# EAGLE design th (EAGLE 9.3.0)
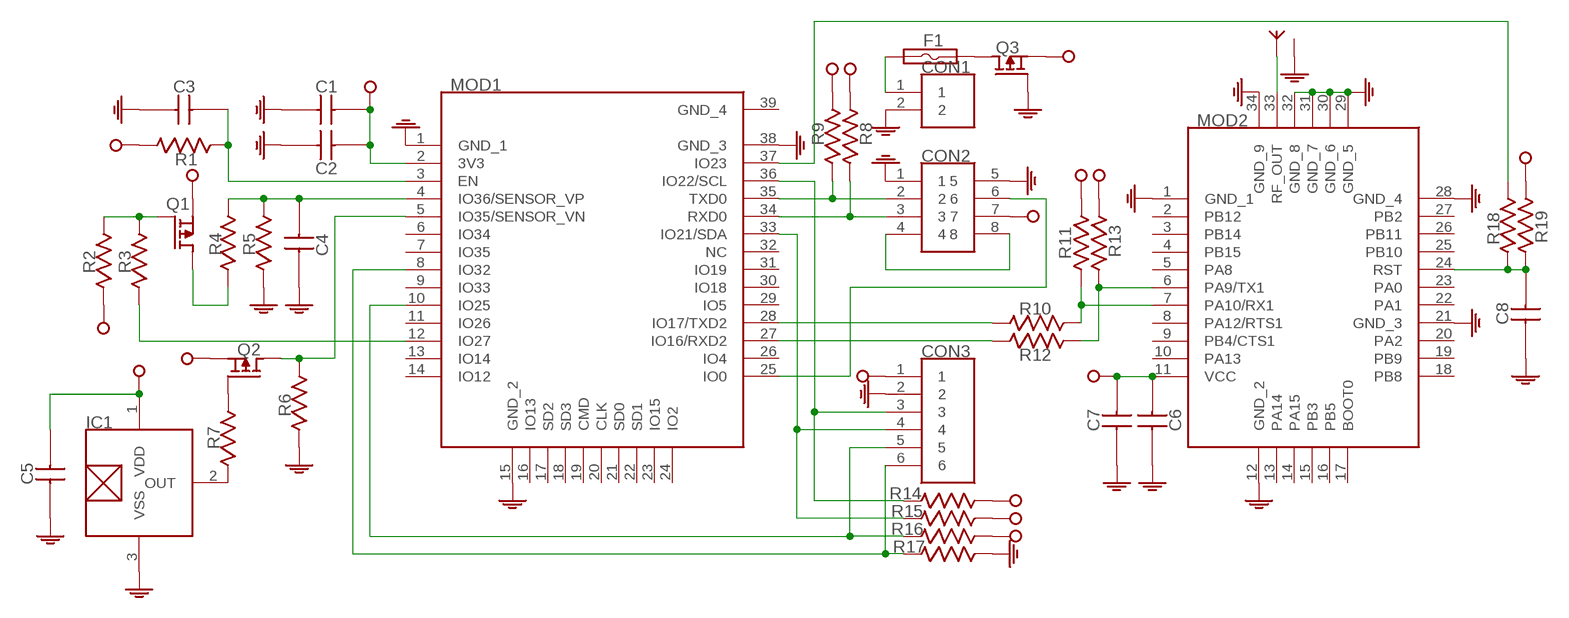
[diagram p0: schematic, sheet 1]

## Parts
ANT1  SMA-RF  [SMA-RF]
C1  CAPACITOR-0805  [0805]
C2  CAPACITOR-0603  [0603]
C3  CAPACITOR-0603  [0603]
C4  CAPACITOR-0603  [0603]
C5  CAPACITOR-0603  [0603]
C6  CAPACITOR-0805  [0805]
C7  CAPACITOR-0603  [0603]
C8  CAPACITOR-0603  [0603]
CON1  JST-PH-2-2.0MM  [JST-PH-2-2.0MM]
CON2  HEADER-8P-2R-DIP-2_0MM  [HEADER-8P-2R-DIP-2_0MM]
CON3  CON-6P-3_81-PLUG  [CON-6P-3_81-PLUG]
F1  FUSE-0805  [0805]
IC1  S-5712-SOT23-3  [SOT23-3]
MOD1  ESP32-WROOM-32D  [ESP32-WROOM-32D]
MOD2  RAK811  [RAK811]
Q1  P-MOSFET  [SOT23-3]
Q2  P-MOSFET  [SOT23-3]
Q3  P-MOSFET  [SOT23-3]
R1  RESISTOR-0603  [0603]
R2  RESISTOR-0603  [0603]
R3  RESISTOR-0603  [0603]
R4  RESISTOR-0603  [0603]
R5  RESISTOR-0603  [0603]
R6  RESISTOR-0603  [0603]
R7  RESISTOR-0603  [0603]
R8  RESISTOR-0603  [0603]
R9  RESISTOR-0603  [0603]
R10  RESISTOR-0603  [0603]
R11  RESISTOR-0603  [0603]
R12  RESISTOR-0603  [0603]
R13  RESISTOR-0603  [0603]
R14  RESISTOR-0603  [0603]
R15  RESISTOR-0603  [0603]
R16  RESISTOR-0603  [0603]
R17  RESISTOR-0603  [0603]
R18  RESISTOR-0603  [0603]
R19  RESISTOR-0603  [0603]

## Nets
GND: ANT1.2(GND) ANT1.3(GND) ANT1.4(GND) ANT1.5(GND) C1.1 C2.1 C3.1 C4.1 C5.1 C6.1 C7.1 C8.1 CON1.2 CON2.1 CON2.5 CON3.2 IC1.3(VSS) MOD1.1(GND_1) MOD1.15(GND_2) MOD1.38(GND_3) MOD2.1(GND_1) MOD2.12(GND_2) MOD2.21(GND_3) MOD2.28(GND_4) MOD2.29(GND_5) MOD2.30(GND_6) MOD2.31(GND_7) MOD2.32(GND_8) MOD2.34(GND_9) Q3.1(G) R5.1 R6.1 R17.2
N$1: C3.2 MOD1.3(EN) R1.2
N$2: IC1.2(OUT) R7.1
N$3: MOD2.6(PA9/TX1) R12.2 R13.2
N$4: MOD2.7(PA10/RX1) R10.2 R11.2
N$5: Q2.1(G) R7.2
N$6: MOD1.28(IO17/TXD2) R10.1
N$7: MOD1.27(IO16/RXD2) R12.1
N$8: CON2.2 MOD1.35(TXD0) R9.1
N$9: CON2.3 MOD1.34(RXD0) R8.1
N$10: CON2.4 CON2.8
N$11: CON2.6 MOD1.25(IO0)
N$12: CON3.4 MOD1.33(IO21/SDA) R15.1
N$13: CON3.3 MOD1.36(IO22/SCL) R14.1
N$14: CON3.5 MOD1.10(IO25) R16.1
N$15: CON3.6 MOD1.8(IO32) R17.1
N$16: Q1.3(D) R4.1
N$17: C4.2 MOD1.4(IO36/SENSOR_VP) R4.2 R5.2
N$18: Q1.1(G) R2.2 R3.2
N$19: MOD1.12(IO27) R3.1
N$20: MOD1.5(IO35/SENSOR_VN) Q2.3(D) R6.2
N$21: ANT1.1(ANT) MOD2.33(RF_OUT)
N$22: C8.2 MOD2.24(RST) R18.1 R19.1
N$23: MOD1.37(IO23) R18.2
N$24: F1.2 Q3.3(D)
N$25: CON1.1 F1.1
VCC: C1.2 C2.2 C5.2 C6.2 C7.2 CON2.7 CON3.1 IC1.1(VDD) MOD1.2(3V3) MOD2.11(VCC) Q1.2(S) Q2.2(S) Q3.2(S) R1.1 R2.1 R8.2 R9.2 R11.1 R13.1 R14.2 R15.2 R16.2 R19.2
Unconnected: MOD1.6(IO34) MOD1.7(IO35) MOD1.9(IO33) MOD1.11(IO26) MOD1.13(IO14) MOD1.14(IO12) MOD1.16(IO13) MOD1.17(SD2) MOD1.18(SD3) MOD1.19(CMD) MOD1.20(CLK) MOD1.21(SD0) MOD1.22(SD1) MOD1.23(IO15) MOD1.24(IO2) MOD1.26(IO4) MOD1.29(IO5) MOD1.30(IO18) MOD1.31(IO19) MOD1.32(NC) MOD2.2(PB12) MOD2.3(PB14) MOD2.4(PB15) MOD2.5(PA8) MOD2.8(PA12/RTS1) MOD2.9(PB4/CTS1) MOD2.10(PA13) MOD2.13(PA14) MOD2.14(PA15) MOD2.15(PB3) MOD2.16(PB5) MOD2.17(BOOT0) MOD2.18(PB8) MOD2.19(PB9) MOD2.20(PA2) MOD2.22(PA1) MOD2.23(PA0) MOD2.25(PB10) MOD2.26(PB11) MOD2.27(PB2)

## Power pins joined to a net without a drawn wire
GND_4: MOD1.39(GND_4)

## Library data of the parts
ANT1 = SamacSys_Parts:SMA-RF
C1 C6 = SamacSys_Parts:CAPACITOR-0805
C2-C5 C7 C8 = SamacSys_Parts:CAPACITOR-0603
CON1 = SamacSys_Parts:JST-PH-2-2.0MM
CON2 = SamacSys_Parts:HEADER-8P-2R-DIP-2_0MM
CON3 = SamacSys_Parts:CON-6P-3_81-PLUG
F1 = SamacSys_Parts:FUSE-0805
IC1 = SamacSys_Parts:S-5712-SOT23-3
MOD1 = SamacSys_Parts:ESP32-WROOM-32D
MOD2 = SamacSys_Parts:RAK811
Q1-Q3 = SamacSys_Parts:P-MOSFET
R1-R19 = SamacSys_Parts:RESISTOR-0603

## Board
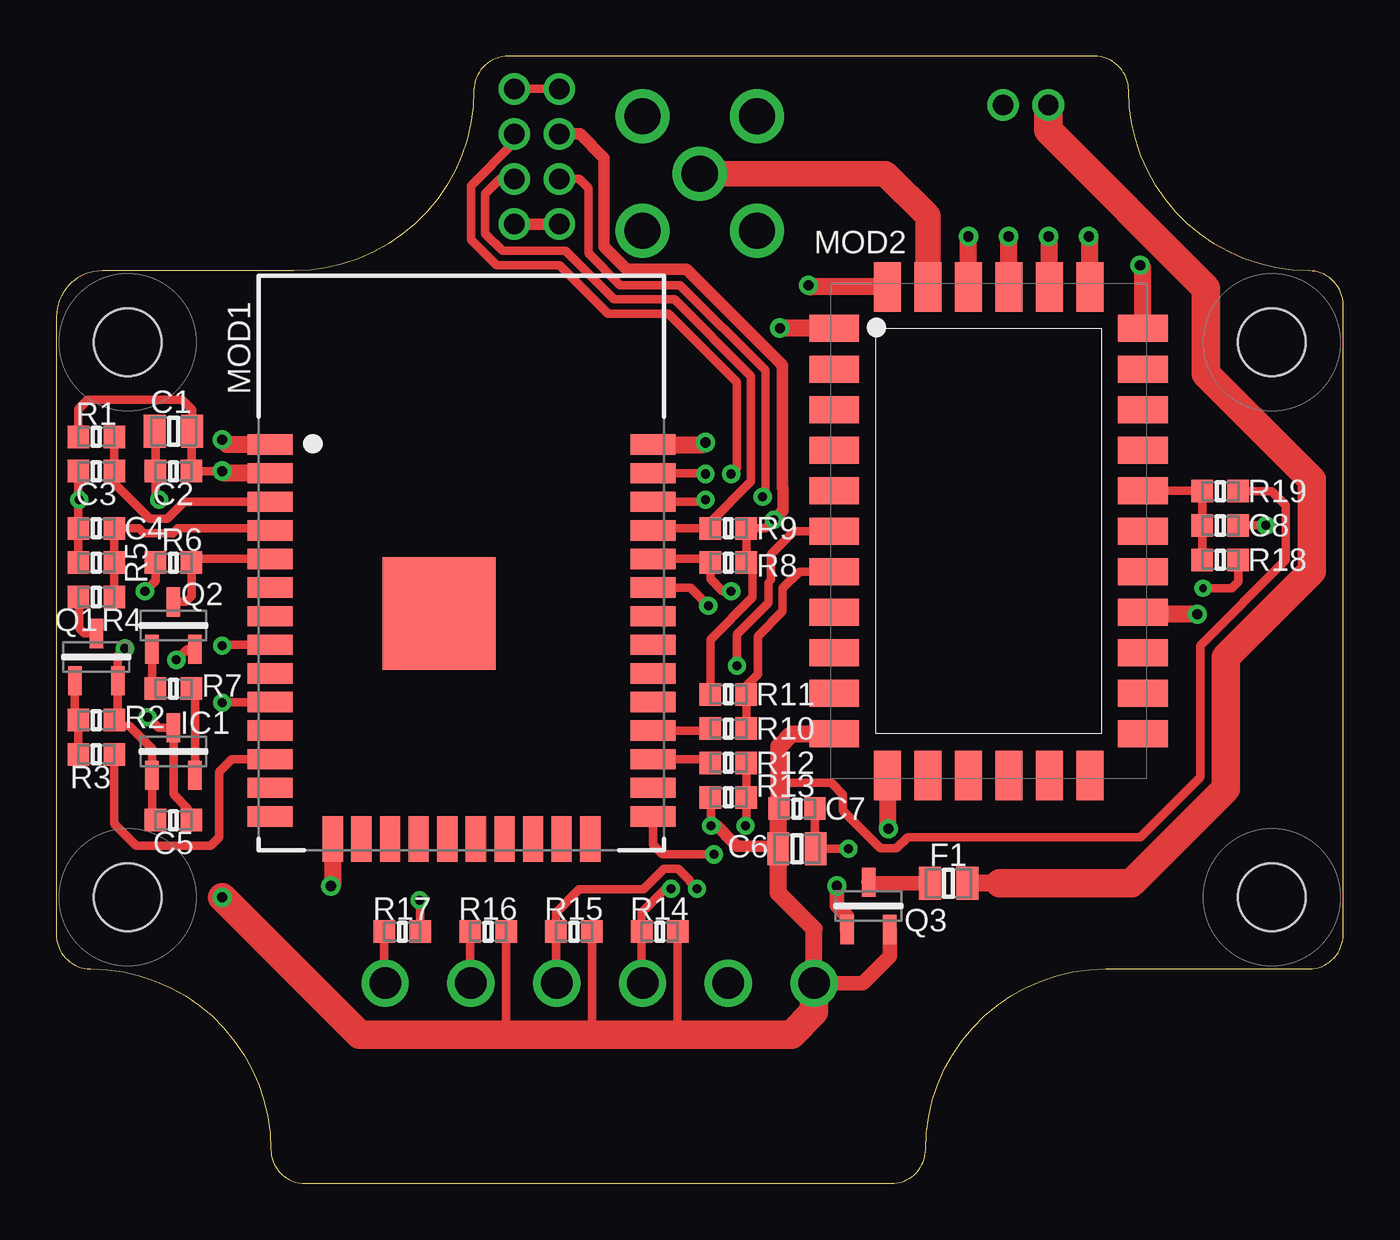
[diagram p1: board, top side]
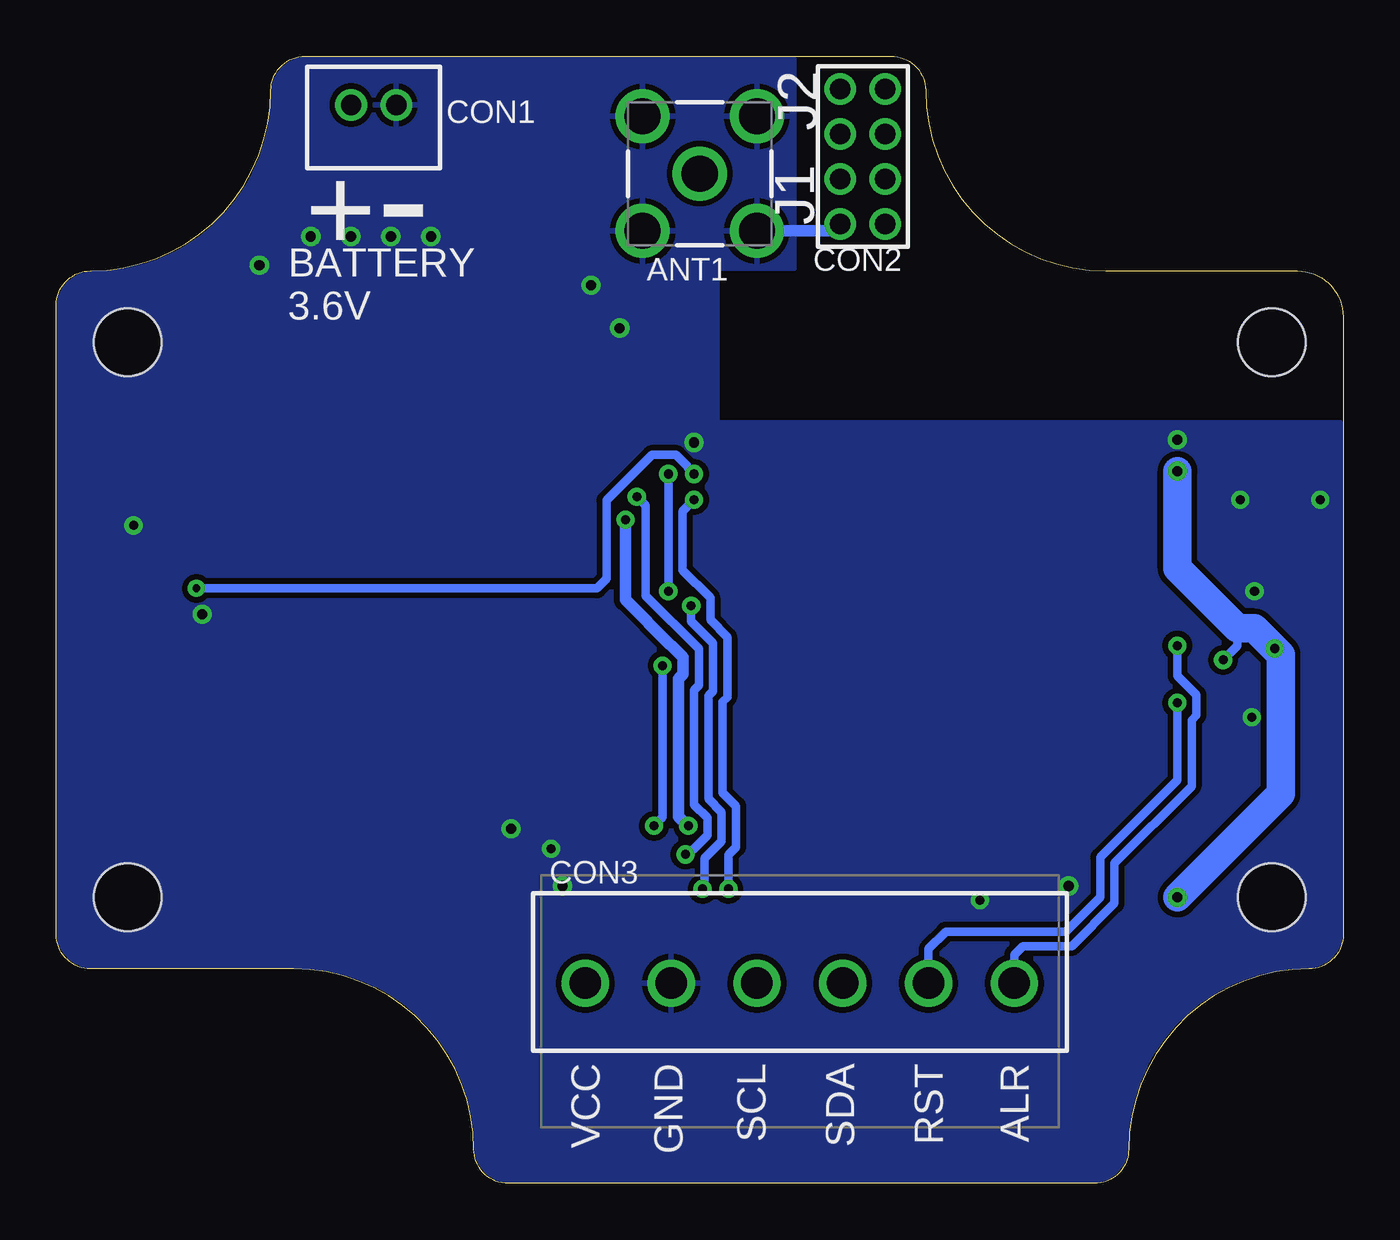
[diagram p2: board, bottom side, seen from below]

Size 57.15 x 50.04 mm. Coordinates in mm from the lower left corner, seen from the top.
Outline: 0,38.48 0,11.05 arc90 1.52,9.53 arc-90 9.53,1.52 arc90 11.05,0 37.08,0 arc90 38.61,1.52 arc-90 46.61,9.53 55.63,9.53 arc90 57.15,11.05 57.15,38.99 arc90 55.63,40.51 arc-90 47.62,48.51 arc90 46.1,50.04 20.07,50.04 arc90 18.54,48.51 arc-90 10.54,40.51 2.03,40.51 arc90 0,38.48
Copper layers (1*16): Top 0.035mm / dielectric 1.5mm / Bottom 0.035mm
Design rules "default": minimum track width 15mil, minimum drill 0.35mm, track to track 10mil, track to pad 10mil, pad to pad 10mil, via to via 10mil, smd to smd 0mil, copper to edge 0mil, drill to drill 6mil, minimum pad ring 10mil, minimum via ring 8mil, stop-mask expansion 4mil, vias tented up to drill 25mil, thermal gap 10mil
Holes 3 mm at 3.17,37.34 53.98,37.34 3.17,12.7 53.98,12.7

### Footprints (pad centres in the part's own frame; a part is rotated, then mirrored left to right if it is on the bottom)
SMA-RF = drill 1.6: 1 0,0; 2 -2.54,2.54; 3 -2.54,-2.54; 4 2.54,-2.54; 5 2.54,2.54
0805 = smd 0.97 x 1.47: 1 -0.83,0; 2 0.83,0
0603 = smd 0.95 x 1: 1 -0.8,0; 2 0.8,0
JST-PH-2-2.0MM = drill 0.9: 1 -1,0; 2 1,0
HEADER-8P-2R-DIP-2_0MM = drill 0.9: 1 -3,-1; 2 -1,-1; 3 1,-1; 4 3,-1; 5 -3,1; 6 -1,1; 7 1,1; 8 3,1
CON-6P-3_81-PLUG = drill 1.4: 1 -9.525,0; 2 -5.715,0; 3 -1.905,0; 4 1.905,0; 5 5.715,0; 6 9.525,0
SOT23-3 = smd 1.3 x 0.6: 1 -1.05,0.95; 2 -1.05,-0.95; 3 1.05,0
ESP32-WROOM-32D = smd 2 x 0.9: 1 -8.537,8.292; 2 -8.537,7.022; 3 -8.537,5.752; 4 -8.537,4.482; 5 -8.537,3.212; 6 -8.537,1.942; 7 -8.537,0.672; 8 -8.537,-0.598; 9 -8.537,-1.868; 10 -8.537,-3.138; 11 -8.537,-4.408; 12 -8.537,-5.678; 13 -8.537,-6.948; 14 -8.537,-8.218; 25 8.463,-8.218; 26 8.463,-6.948; 27 8.463,-5.678; 28 8.463,-4.408; 29 8.463,-3.138; 30 8.463,-1.868; 31 8.463,-0.598; 32 8.463,0.672; 33 8.463,1.942; 34 8.463,3.212; 35 8.463,4.482; 36 8.463,5.752; 37 8.463,7.022; 38 8.463,8.292 | smd 0.9 x 2: 15 -5.752,-9.218; 16 -4.482,-9.218; 17 -3.212,-9.218; 18 -1.942,-9.218; 19 -0.672,-9.218; 20 0.598,-9.218; 21 1.868,-9.218; 22 3.138,-9.218; 23 4.408,-9.218; 24 5.678,-9.218 | smd 5 x 5: 39 -1.037,0.792
RAK811 = smd 2.2 x 1.2: 1 -6.85,9; 2 -6.85,7.2; 3 -6.85,5.4; 4 -6.85,3.6; 5 -6.85,1.8; 6 -6.85,0; 7 -6.85,-1.8; 8 -6.85,-3.6; 9 -6.85,-5.4; 10 -6.85,-7.2; 11 -6.85,-9; 18 6.85,-9; 19 6.85,-7.2; 20 6.85,-5.4; 21 6.85,-3.6; 22 6.85,-1.8; 23 6.85,0; 24 6.85,1.8; 25 6.85,3.6; 26 6.85,5.4; 27 6.85,7.2; 28 6.85,9 | smd 1.2 x 2.2: 12 -4.5,-10.85; 13 -2.7,-10.85; 14 -0.9,-10.85; 15 0.9,-10.85; 16 2.7,-10.85; 17 4.5,-10.85; 29 4.5,10.85; 30 2.7,10.85; 31 0.9,10.85; 32 -0.9,10.85; 33 -2.7,10.85; 34 -4.5,10.85

### Placement (x,y rotation side)
ANT1  28.57,44.83 0 bottom
C1  5.21,33.4 0 top
C2  5.21,31.62 0 top
C3  1.78,31.62 0 top
C4  1.78,29.08 0 top
C5  5.21,16.13 180 top
C6  32.89,14.86 180 top
C7  32.89,16.64 180 top
C8  51.69,29.21 180 top
CON1  43.05,47.88 0 bottom
CON2  21.34,45.59 90 bottom
CON3  24.13,8.89 0 bottom
F1  39.62,13.34 180 top
IC1  5.21,19.18 90 top
MOD1  18.03,24.51 0 top
MOD2  41.4,28.96 0 top
Q1  1.78,23.37 90 top
Q2  5.21,24.77 90 top
Q3  36.07,12.32 90 top
R1  1.78,33.15 0 top
R2  1.78,20.57 180 top
R3  1.78,19.05 180 top
R4  1.78,26.04 0 top
R5  1.78,27.56 0 top
R6  5.21,27.56 0 top
R7  5.21,21.97 180 top
R8  29.84,27.56 0 top
R9  29.84,29.08 0 top
R10  29.84,20.19 0 top
R11  29.84,21.72 0 top
R12  29.84,18.67 0 top
R13  29.84,17.14 0 top
R14  26.8,11.18 0 top
R15  22.99,11.18 0 top
R16  19.18,11.18 0 top
R17  15.37,11.18 0 top
R18  51.69,27.69 0 top
R19  51.69,30.73 0 top

### Tracks (layer width: path | path; a pad name or v marks a point on that pad's centre or on a via)
GND  (via drill 0.4, 0.45)
  Top 0.381: C8.1 v53.72,29.21 | v4.57,30.35 4.41,30.52 C2.1 4.41,33.37 C1.1 | R6.1 4.41,26.76 v3.94,26.29 | C3.1 0.98,30.39 | 0.98,30.39 v1.02,30.35 | 0.98,30.39 C4.1 R5.1 | v4.06,20.7 4.54,20.23 IC1.3 5.21,17.27 5.84,16.64 5.84,16.29 C5.1 | R17.2 16.17,12.54 v16.13,12.57 | C7.1 33.69,14.89 C6.1 v35.18,14.86
  Top 0.508: CON2.1 CON2.5
  Top 0.635: Q3.1 35.12,11.87 34.67,12.32 v34.67,13.21
  Top 0.762: MOD2.21 48.34,25.27 v50.67,25.27 | MOD1.1 7.58,32.8 v7.37,33.02 | MOD1.38 28.74,32.8 v28.83,32.89 | MOD2.1 32.15,37.96 v32.13,37.97 | MOD2.34 33.47,39.81 v33.4,39.88 | MOD2.32 40.5,42.03 v40.51,42.04 | MOD2.31 42.3,42.03 v42.29,42.04 | MOD2.30 44.1,42 v44.07,42.04 | MOD2.29 45.9,41.98 v45.85,42.04 | MOD2.28 48.25,40.65 v48.13,40.77 | MOD2.12 36.9,15.8 v36.96,15.75 | MOD1.15 12.28,13.3 v12.19,13.21
  Bottom 0.508: CON2.5 22.64,42.29 ANT1.4
  pour Bottom: 1.65,9.65 arc-90 0.13,11.18 0.13,33.78 27.81,33.78 27.81,40.64 24.38,40.64 24.38,49.91 45.97,49.91 arc-90 47.5,48.39 arc90 55.5,40.39 arc-90 57.02,38.86 57.02,11.18 arc-90 55.5,9.65 46.48,9.65 arc90 38.48,1.65 arc-90 36.96,0.13 11.18,0.13 arc-90 9.65,1.65 arc90
N$1
  Top 0.381: MOD1.3 5.68,30.26 4.92,29.5 4.15,29.5 2.58,31.08 C3.2 R1.2
N$2
  Top 0.381: IC1.2 6.16,21.82 R7.1
N$3  (via drill 0.4)
  Top 0.381: R12.2 R13.2 30.64,15.91 v30.61,15.88 | v30.23,22.99 30.23,24.38 31.62,25.78 31.62,26.68 31.75,26.8 31.75,27.93 32.77,28.96 MOD2.6
  Bottom 0.381: v30.61,15.88 30.23,16.26 v30.23,22.99
N$4
  Top 0.381: R10.2 R11.2 30.64,22.1 31.15,22.61 31.15,24.3 32.26,25.4 32.26,26.42 33,27.16 MOD2.7
N$5
  Top 0.381: Q2.1 4.26,22.12 R7.2
N$6
  Top 0.381: MOD1.28 28.95,20.1 R10.1
N$7
  Top 0.381: MOD1.27 28.88,18.83 R12.1
N$8
  Top 0.381: CON2.2 19.7,44.59 19.05,43.94 19.05,42.16 19.81,41.4 22.62,41.4 24.77,39.25 27.45,39.25 30.86,35.83 30.86,31.17 29.05,29.36 R9.1 26.59,29.08 MOD1.35
N$9  (via drill 0.4)
  Top 0.381: v29.97,26.29 29.59,26.29 29.05,26.84 R8.1 28.88,27.72 MOD1.34 | v29.97,31.5 30.23,31.75 30.23,35.57 27.18,38.61 24.51,38.61 22.36,40.77 19.55,40.77 18.41,41.9 18.41,44.3 20.34,46.22 CON2.3
  Bottom 0.381: v29.97,26.29 v29.97,31.5
N$10
  Top 0.381: CON2.4 CON2.8
N$11  (via drill 0.4)
  Top 0.381: v31.37,30.48 31.5,30.61 31.5,36.1 27.71,39.88 25.04,39.88 23.63,41.29 23.63,44.19 23.23,44.59 CON2.6 | v29.21,14.61 26.92,14.61 26.5,15.03 MOD1.25
  Bottom 0.381: v29.21,14.61 29.08,14.61 28.23,15.45 28.23,16.23 28.83,16.82 28.83,21.91 28.62,22.12 28.62,23.73 30.99,26.1 30.99,30.1 v31.37,30.48
N$12  (via drill 0.4)
  Top 0.381: MOD1.33 28.16,26.45 v28.96,25.65 | CON3.4 22.19,8.93 R15.1 22.19,12.03 23.21,13.05 26.08,13.05 27,13.97 27.61,13.97 28.15,13.43 28.15,13.38 v28.45,13.08
  Bottom 0.381: v28.96,25.65 28.96,24.97 27.98,23.99 27.98,21.86 28.19,21.64 28.19,17.08 27.6,16.49 27.6,15.19 28.36,14.43 28.36,13.17 v28.45,13.08
N$13  (via drill 0.4)
  Top 0.381: MOD1.36 28.74,30.26 v28.83,30.35 | CON3.3 26,8.93 R14.1 26,12.03 27.05,13.08 v27.3,13.08
  Bottom 0.381: v28.83,30.35 29.34,29.84 29.34,27.23 28.11,26 28.11,25.02 27.35,24.25 27.35,21.59 27.56,21.38 27.56,17.35 26.96,16.75 26.96,14.93 27.3,14.59 v27.3,13.08
N$14  (via drill 0.4)
  Top 0.381: MOD1.10 7.4,21.37 v7.37,21.34 | R16.1 18.38,8.93 CON3.5
  Bottom 0.381: v7.37,21.34 7.37,17.91 10.79,14.48 10.79,12.7 12.32,11.18 17.65,11.18 18.41,10.41 CON3.5
N$15  (via drill 0.4)
  Top 0.381: MOD1.8 7.4,23.91 v7.37,23.88 | R17.1 14.57,8.93 CON3.6
  Bottom 0.381: v7.37,23.88 7.37,22.54 6.52,21.69 6.52,20.79 6.73,20.57 6.73,17.64 10.16,14.21 10.16,12.44 12.06,10.54 14.22,10.54 14.61,10.16 CON3.6
N$16
  Top 0.381: Q1.3 1.24,24.42 1.02,24.64 1.02,26 R4.1
N$17
  Top 0.381: MOD1.4 9.41,29.08 5.4,29.08 5.19,28.87 3.89,28.87 3.67,29.08 C4.2 R5.2 R4.2
N$18
  Top 0.381: Q1.1 0.83,20.72 R2.2 R3.2
N$19
  Top 0.381: R3.1 2.58,15.96 3.56,14.99 6.86,14.99 7.24,15.37 7.24,18.29 7.78,18.83 MOD1.12
N$20
  Top 0.381: MOD1.5 6.17,27.72 R6.2 6.01,26.07 5.75,25.82 Q2.3
N$21
  Top 1.143: MOD2.33 38.7,42.96 36.83,44.83 ANT1.1
N$22
  Top 0.381: MOD2.24 50.87,30.76 R19.1 C8.2 R18.1
N$23  (via drill 0.35, 0.4)
  Top 0.381: R18.2 52.49,26.71 52.2,26.42 v50.93,26.42 | MOD1.37 28.79,31.53 v28.83,31.5
  Bottom 0.381: v28.83,31.5 29.12,31.79 29.12,31.85 29.62,32.34 30.7,32.34 32.73,30.32 32.73,26.84 33.15,26.42 v50.93,26.42
N$24
  Top 0.635: F1.2 36.1,13.34 Q3.3
N$25
  Top 0.762: 41.91,13.34 F1.1
  Top 1.27: CON1.1 44.05,46.75 51.05,39.75 51.05,35.94 55.75,31.24 55.75,27.18 51.94,23.37 51.94,17.53 47.75,13.34 41.91,13.34
VCC  (via drill 0.4, 0.45)
  Top 0.381: R19.2 53.98,30.73 54.61,30.1 54.61,27.69 50.8,23.88 50.8,18.03 48.13,15.37 37.81,15.37 37.32,14.88 36.6,14.88 34.93,16.54 34.93,17.26 34.42,17.78 32.09,17.78 | R1.1 0.98,34.38 1.4,34.8 5.59,34.8 6.04,34.35 C1.2 6.01,33.37 C2.2 v7.37,31.62 | C5.2 4.26,16.28 IC1.1 4.26,19.31 3.25,20.32 2.83,20.32 R2.1 2.73,20.72 Q1.2 2.73,23.43 v3.05,23.75 | Q2.2 5.81,23.71 v5.33,23.24 | v31.88,29.46 31.5,29.08 R9.2 R8.2 30.91,27.29 30.91,26.02 29.05,24.15 R11.1 | R13.1 29.08,17.11 v29.08,15.88 | R16.2 19.98,6.64 19.94,6.6 | R15.2 23.79,6.69 23.88,6.6 | R14.2 27.6,6.95 27.94,6.6
  Top 0.508: v31.88,29.46 32.28,29.87 32.28,30.86 32.26,30.88 32.26,36.32 28,40.58 25.33,40.58 24.33,41.58 24.33,45.52 23.26,46.59 CON2.7 | v29.08,15.88 29.34,15.88 29.7,15.52 29.7,15.5 30.23,14.96 31.96,14.96 C6.2 | 32.06,16.61 C7.2
  Top 0.635: Q3.2 37.02,10.09 35.81,8.89 CON3.1
  Top 0.762: MOD1.2 7.46,31.53 v7.37,31.62 | 32.06,16.61 C6.2 32.06,12.89 33.66,11.3 CON3.1 | C7.2 32.09,17.78 32.09,19.39 32.66,19.96 MOD2.11
  Top 1.27: CON3.1 33.66,7.62 32.64,6.6 27.94,6.6 23.88,6.6 19.94,6.6 13.46,6.6 v7.37,12.7
  Bottom 0.381: v5.33,23.24 4.7,23.88 4.7,24.64
  Bottom 0.508: v29.08,15.88 29.13,15.88 29.53,16.28 29.53,22.4 29.32,22.61 29.32,23.36 29.85,23.9 29.87,23.9 31.88,25.91 v31.88,29.46
  Bottom 1.27: v7.37,12.7 2.77,17.29 2.77,23.47 v3.05,23.75 3.94,24.64 4.7,24.64 7.37,27.3 v7.37,31.62

### Text on the board
bNames: J2 | J1 | - | + | BATTERY / 3.6V | ALR | RST | SDA | SCL | GND | VCC